# EAGLE design Nixie Clock Display Board IN14 (EAGLE 9.6.0)
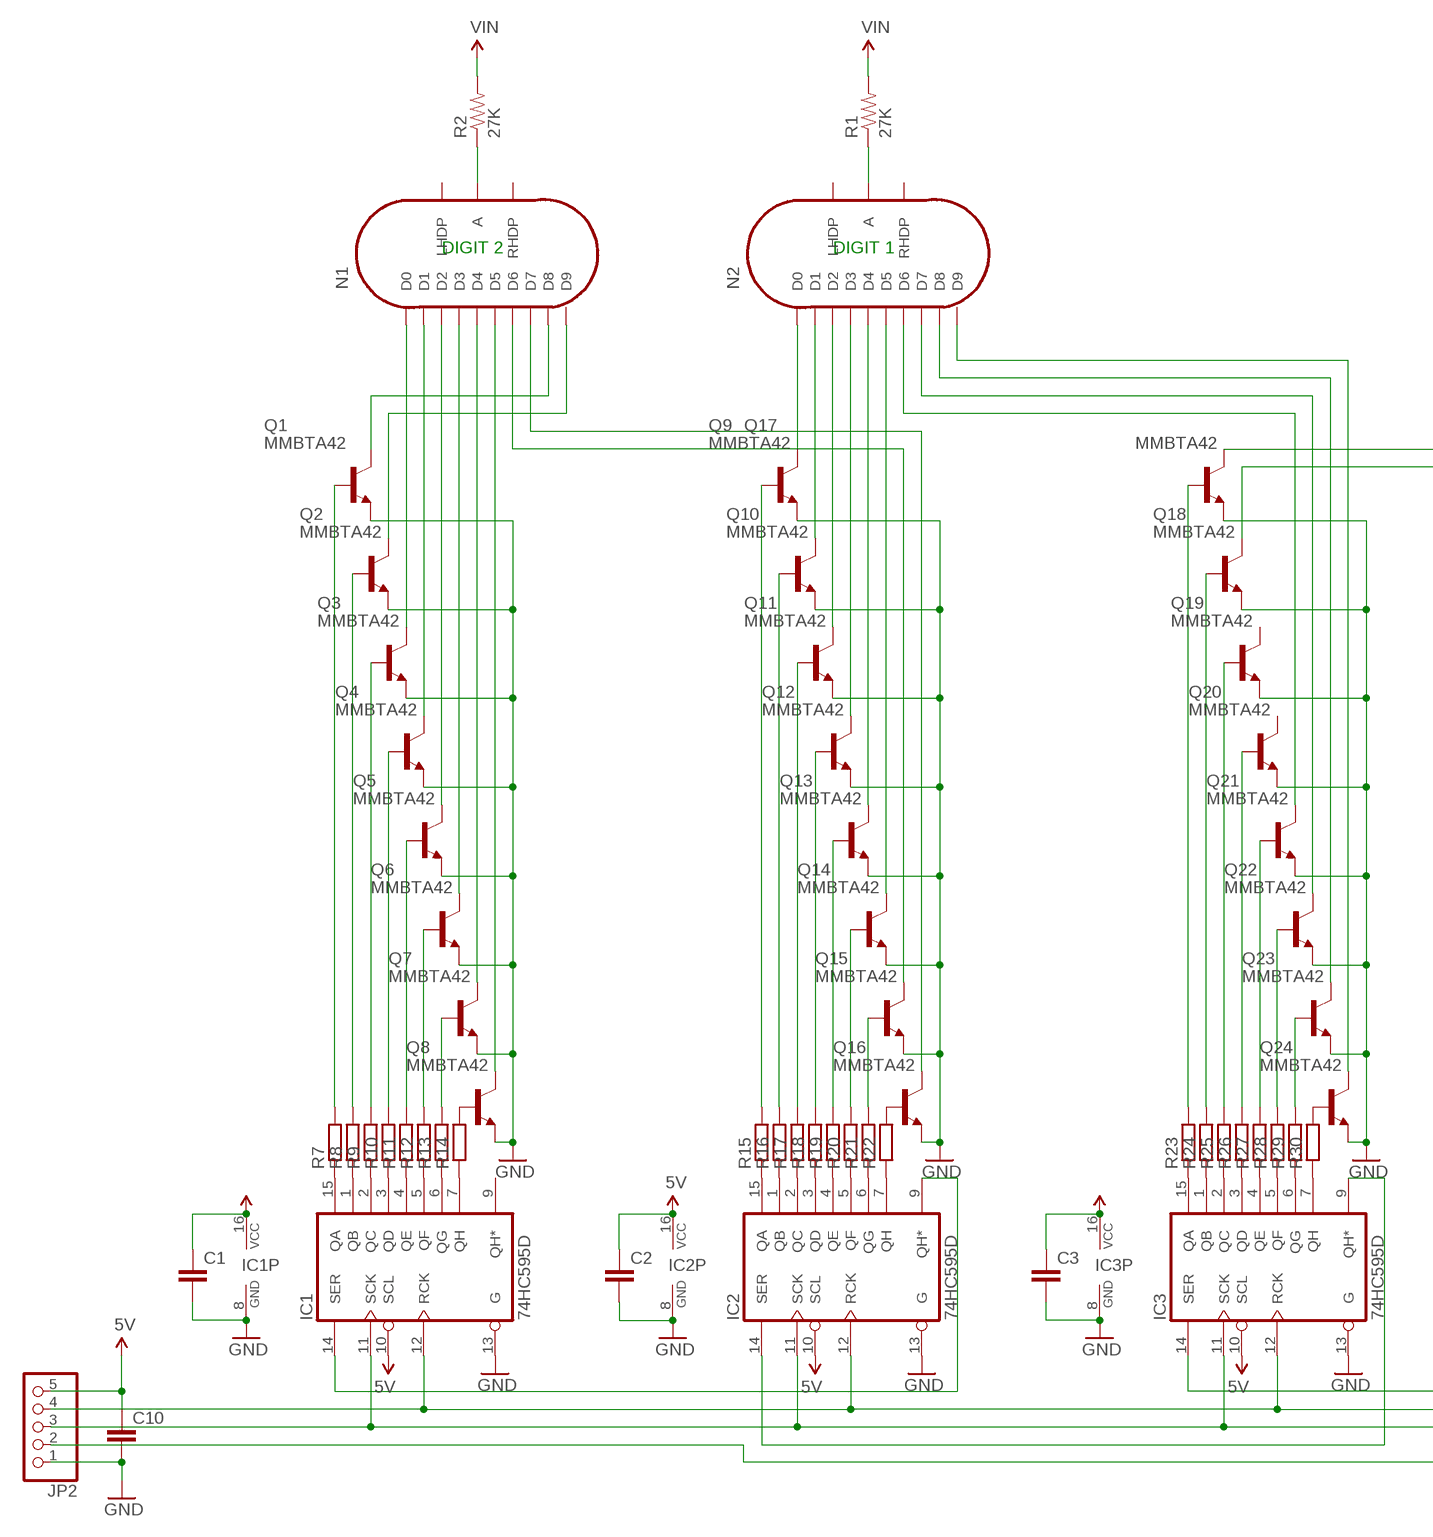
[diagram p0: schematic, sheet 1, part 1 of 2]
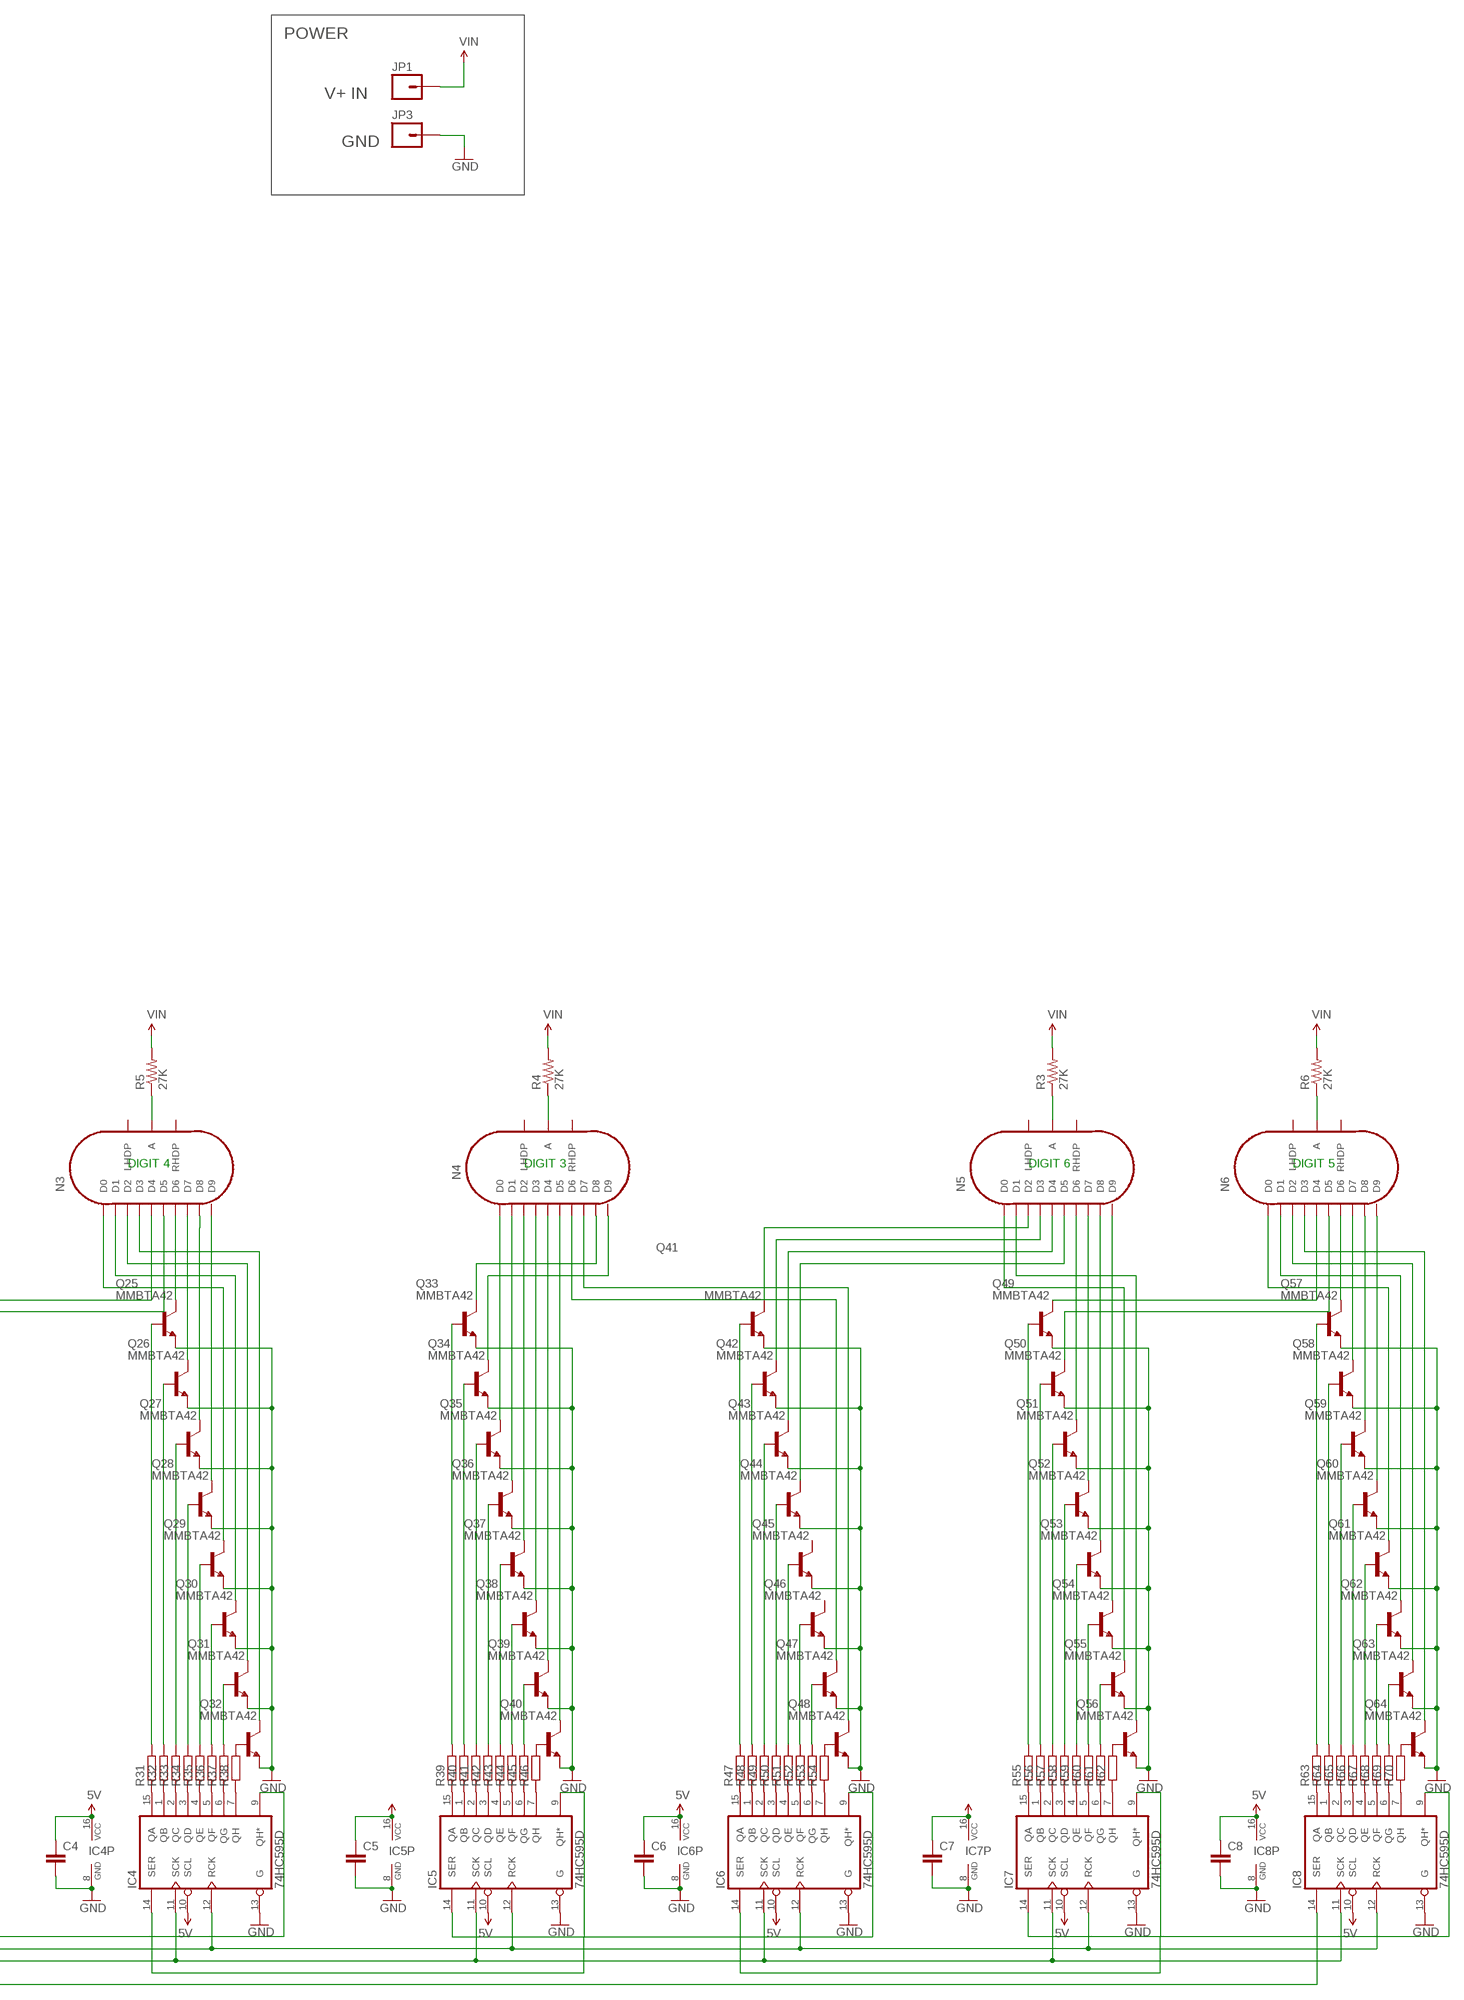
[diagram p1: schematic, sheet 1, part 2 of 2]

## Parts
C1  C-EUC0805  [C0805]
C2  C-EUC0805  [C0805]
C3  C-EUC0805  [C0805]
C4  C-EUC0805  [C0805]
C5  C-EUC0805  [C0805]
C6  C-EUC0805  [C0805]
C7  C-EUC0805  [C0805]
C8  C-EUC0805  [C0805]
C10  C-EUC0805  [C0805]
IC1  74HC595D  [SO16]
IC2  74HC595D  [SO16]
IC3  74HC595D  [SO16]
IC4  74HC595D  [SO16]
IC5  74HC595D  [SO16]
IC6  74HC595D  [SO16]
IC7  74HC595D  [SO16]
IC8  74HC595D  [SO16]
JP1  M01PTH  [1X01]
JP2  PINHD-1X5  [1X05]
JP3  M01PTH  [1X01]
N1  IN-14  [IN-14]
N2  IN-14  [IN-14]
N3  IN-14  [IN-14]
N4  IN-14  [IN-14]
N5  IN-14  [IN-14]
N6  IN-14  [IN-14]
Q1  MMBTA42  [SOT23]
Q2  MMBTA42  [SOT23]
Q3  MMBTA42  [SOT23]
Q4  MMBTA42  [SOT23]
Q5  MMBTA42  [SOT23]
Q6  MMBTA42  [SOT23]
Q7  MMBTA42  [SOT23]
Q8  MMBTA42  [SOT23]
Q9  MMBTA42  [SOT23]
Q10  MMBTA42  [SOT23]
Q11  MMBTA42  [SOT23]
Q12  MMBTA42  [SOT23]
Q13  MMBTA42  [SOT23]
Q14  MMBTA42  [SOT23]
Q15  MMBTA42  [SOT23]
Q16  MMBTA42  [SOT23]
Q17  MMBTA42  [SOT23]
Q18  MMBTA42  [SOT23]
Q19  MMBTA42  [SOT23]
Q20  MMBTA42  [SOT23]
Q21  MMBTA42  [SOT23]
Q22  MMBTA42  [SOT23]
Q23  MMBTA42  [SOT23]
Q24  MMBTA42  [SOT23]
Q25  MMBTA42  [SOT23]
Q26  MMBTA42  [SOT23]
Q27  MMBTA42  [SOT23]
Q28  MMBTA42  [SOT23]
Q29  MMBTA42  [SOT23]
Q30  MMBTA42  [SOT23]
Q31  MMBTA42  [SOT23]
Q32  MMBTA42  [SOT23]
Q33  MMBTA42  [SOT23]
Q34  MMBTA42  [SOT23]
Q35  MMBTA42  [SOT23]
Q36  MMBTA42  [SOT23]
Q37  MMBTA42  [SOT23]
Q38  MMBTA42  [SOT23]
Q39  MMBTA42  [SOT23]
Q40  MMBTA42  [SOT23]
Q41  MMBTA42  [SOT23]
Q42  MMBTA42  [SOT23]
Q43  MMBTA42  [SOT23]
Q44  MMBTA42  [SOT23]
Q45  MMBTA42  [SOT23]
Q46  MMBTA42  [SOT23]
Q47  MMBTA42  [SOT23]
Q48  MMBTA42  [SOT23]
Q49  MMBTA42  [SOT23]
Q50  MMBTA42  [SOT23]
Q51  MMBTA42  [SOT23]
Q52  MMBTA42  [SOT23]
Q53  MMBTA42  [SOT23]
Q54  MMBTA42  [SOT23]
Q55  MMBTA42  [SOT23]
Q56  MMBTA42  [SOT23]
Q57  MMBTA42  [SOT23]
Q58  MMBTA42  [SOT23]
Q59  MMBTA42  [SOT23]
Q60  MMBTA42  [SOT23]
Q61  MMBTA42  [SOT23]
Q62  MMBTA42  [SOT23]
Q63  MMBTA42  [SOT23]
Q64  MMBTA42  [SOT23]
R1  27K  RESISTORPTH-1/2W  [AXIAL-0.5]
R2  27K  RESISTORPTH-1/2W  [AXIAL-0.5]
R3  27K  RESISTORPTH-1/2W  [AXIAL-0.5]
R4  27K  RESISTORPTH-1/2W  [AXIAL-0.5]
R5  27K  RESISTORPTH-1/2W  [AXIAL-0.5]
R6  27K  RESISTORPTH-1/2W  [AXIAL-0.5]
R7  R-EU_R0805  [R0805]
R8  R-EU_R0805  [R0805]
R9  R-EU_R0805  [R0805]
R10  R-EU_R0805  [R0805]
R11  R-EU_R0805  [R0805]
R12  R-EU_R0805  [R0805]
R13  R-EU_R0805  [R0805]
R14  R-EU_R0805  [R0805]
R15  R-EU_R0805  [R0805]
R16  R-EU_R0805  [R0805]
R17  R-EU_R0805  [R0805]
R18  R-EU_R0805  [R0805]
R19  R-EU_R0805  [R0805]
R20  R-EU_R0805  [R0805]
R21  R-EU_R0805  [R0805]
R22  R-EU_R0805  [R0805]
R23  R-EU_R0805  [R0805]
R24  R-EU_R0805  [R0805]
R25  R-EU_R0805  [R0805]
R26  R-EU_R0805  [R0805]
R27  R-EU_R0805  [R0805]
R28  R-EU_R0805  [R0805]
R29  R-EU_R0805  [R0805]
R30  R-EU_R0805  [R0805]
R31  R-EU_R0805  [R0805]
R32  R-EU_R0805  [R0805]
R33  R-EU_R0805  [R0805]
R34  R-EU_R0805  [R0805]
R35  R-EU_R0805  [R0805]
R36  R-EU_R0805  [R0805]
R37  R-EU_R0805  [R0805]
R38  R-EU_R0805  [R0805]
R39  R-EU_R0805  [R0805]
R40  R-EU_R0805  [R0805]
R41  R-EU_R0805  [R0805]
R42  R-EU_R0805  [R0805]
R43  R-EU_R0805  [R0805]
R44  R-EU_R0805  [R0805]
R45  R-EU_R0805  [R0805]
R46  R-EU_R0805  [R0805]
R47  R-EU_R0805  [R0805]
R48  R-EU_R0805  [R0805]
R49  R-EU_R0805  [R0805]
R50  R-EU_R0805  [R0805]
R51  R-EU_R0805  [R0805]
R52  R-EU_R0805  [R0805]
R53  R-EU_R0805  [R0805]
R54  R-EU_R0805  [R0805]
R55  R-EU_R0805  [R0805]
R56  R-EU_R0805  [R0805]
R57  R-EU_R0805  [R0805]
R58  R-EU_R0805  [R0805]
R59  R-EU_R0805  [R0805]
R60  R-EU_R0805  [R0805]
R61  R-EU_R0805  [R0805]
R62  R-EU_R0805  [R0805]
R63  R-EU_R0805  [R0805]
R64  R-EU_R0805  [R0805]
R65  R-EU_R0805  [R0805]
R66  R-EU_R0805  [R0805]
R67  R-EU_R0805  [R0805]
R68  R-EU_R0805  [R0805]
R69  R-EU_R0805  [R0805]
R70  R-EU_R0805  [R0805]

## Nets
5V: C1.1 C2.1 C3.1 C4.1 C5.1 C6.1 C7.1 C8.1 C10.1 IC1.10(SCL) IC1.16(VCC) IC2.10(SCL) IC2.16(VCC) IC3.10(SCL) IC3.16(VCC) IC4.10(SCL) IC4.16(VCC) IC5.10(SCL) IC5.16(VCC) IC6.10(SCL) IC6.16(VCC) IC7.10(SCL) IC7.16(VCC) IC8.10(SCL) IC8.16(VCC) JP2.5
GND: C1.2 C2.2 C3.2 C4.2 C5.2 C6.2 C7.2 C8.2 C10.2 IC1.8(GND) IC1.13(G) IC2.8(GND) IC2.13(G) IC3.8(GND) IC3.13(G) IC4.8(GND) IC4.13(G) IC5.8(GND) IC5.13(G) IC6.8(GND) IC6.13(G) IC7.8(GND) IC7.13(G) IC8.8(GND) IC8.13(G) JP2.1 JP3.1 Q1.2(E) Q2.2(E) Q3.2(E) Q4.2(E) Q5.2(E) Q6.2(E) Q7.2(E) Q8.2(E) Q9.2(E) Q10.2(E) Q11.2(E) Q12.2(E) Q13.2(E) Q14.2(E) Q15.2(E) Q16.2(E) Q17.2(E) Q18.2(E) Q19.2(E) Q20.2(E) Q21.2(E) Q22.2(E) Q23.2(E) Q24.2(E) Q25.2(E) Q26.2(E) Q27.2(E) Q28.2(E) Q29.2(E) Q30.2(E) Q31.2(E) Q32.2(E) Q33.2(E) Q34.2(E) Q35.2(E) Q36.2(E) Q37.2(E) Q38.2(E) Q39.2(E) Q40.2(E) Q41.2(E) Q42.2(E) Q43.2(E) Q44.2(E) Q45.2(E) Q46.2(E) Q47.2(E) Q48.2(E) Q49.2(E) Q50.2(E) Q51.2(E) Q52.2(E) Q53.2(E) Q54.2(E) Q55.2(E) Q56.2(E) Q57.2(E) Q58.2(E) Q59.2(E) Q60.2(E) Q61.2(E) Q62.2(E) Q63.2(E) Q64.2(E)
IN1: IC8.14(SER) JP2.2
IN2: IC1.12(RCK) IC2.12(RCK) IC3.12(RCK) IC4.12(RCK) IC5.12(RCK) IC6.12(RCK) IC7.12(RCK) IC8.12(RCK) JP2.4
IN5: IC1.11(SCK) IC2.11(SCK) IC3.11(SCK) IC4.11(SCK) IC5.11(SCK) IC6.11(SCK) IC7.11(SCK) IC8.11(SCK) JP2.3
IN7: IC2.14(SER) IC3.9(QH*)
IN8: IC4.14(SER) IC5.9(QH*)
IN12: IC5.14(SER) IC6.9(QH*)
IN13: IC6.14(SER) IC7.9(QH*)
N$1: Q1.1(B) R7.2
N$2: IC1.15(QA) R7.1
N$3: IC1.1(QB) R8.1
N$4: IC1.2(QC) R9.1
N$5: IC1.3(QD) R10.1
N$6: IC1.4(QE) R11.1
N$7: IC1.5(QF) R12.1
N$8: IC1.6(QG) R13.1
N$9: IC1.7(QH) R14.1
N$10: Q8.1(B) R14.2
N$11: Q7.1(B) R13.2
N$12: Q6.1(B) R12.2
N$13: Q5.1(B) R11.2
N$14: Q4.1(B) R10.2
N$15: Q3.1(B) R9.2
N$16: Q2.1(B) R8.2
N$17: Q9.1(B) R15.2
N$18: Q16.1(B) R22.2
N$19: Q15.1(B) R21.2
N$20: Q14.1(B) R20.2
N$21: Q13.1(B) R19.2
N$22: Q12.1(B) R18.2
N$25: Q11.1(B) R17.2
N$26: Q10.1(B) R16.2
N$27: N6.D0 Q61.3(C)
N$28: IC1.14(SER) IC2.9(QH*)
N$29: N5.A R3.P$1
N$30: IC2.15(QA) R15.1
N$31: IC2.1(QB) R16.1
N$32: IC2.2(QC) R17.1
N$33: IC2.3(QD) R18.1
N$34: IC2.4(QE) R19.1
N$35: IC2.5(QF) R20.1
N$36: IC2.6(QG) R21.1
N$37: IC2.7(QH) R22.1
N$38: Q17.1(B) R23.2
N$39: Q24.1(B) R30.2
N$40: N6.A R6.P$1
N$41: Q23.1(B) R29.2
N$42: Q22.1(B) R28.2
N$43: Q21.1(B) R27.2
N$44: Q20.1(B) R26.2
N$45: Q19.1(B) R25.2
N$46: Q18.1(B) R24.2
N$47: IC3.15(QA) R23.1
N$48: IC3.1(QB) R24.1
N$49: IC3.2(QC) R25.1
N$50: IC3.3(QD) R26.1
N$51: IC3.4(QE) R27.1
N$52: IC3.5(QF) R28.1
N$53: IC3.6(QG) R29.1
N$54: IC3.7(QH) R30.1
N$55: N4.A R4.P$1
N$56: N3.A R5.P$1
N$57: IC3.14(SER) IC4.9(QH*)
N$58: N6.D1 Q62.3(C)
N$59: IC7.14(SER) IC8.9(QH*)
N$60: N6.D2 Q63.3(C)
N$61: N6.D3 Q64.3(C)
N$63: Q25.1(B) R31.2
N$64: Q32.1(B) R38.2
N$65: Q31.1(B) R37.2
N$66: Q30.1(B) R36.2
N$67: Q29.1(B) R35.2
N$68: Q28.1(B) R34.2
N$69: Q27.1(B) R33.2
N$70: Q26.1(B) R32.2
N$71: IC4.15(QA) R31.1
N$72: IC4.1(QB) R32.1
N$73: IC4.2(QC) R33.1
N$74: IC4.3(QD) R34.1
N$75: IC4.4(QE) R35.1
N$76: IC4.5(QF) R36.1
N$77: IC4.6(QG) R37.1
N$78: IC4.7(QH) R38.1
N$79: Q33.1(B) R39.2
N$80: Q40.1(B) R46.2
N$81: Q39.1(B) R45.2
N$82: Q38.1(B) R44.2
N$83: N2.A R1.P$1
N$84: N1.A R2.P$1
N$87: N6.D4 Q49.3(C)
N$88: N6.D5 Q50.3(C)
N$89: N6.D6 Q57.3(C)
N$90: N6.D7 Q58.3(C)
N$91: N6.D8 Q59.3(C)
N$92: N6.D9 Q60.3(C)
N$95: Q37.1(B) R43.2
N$96: Q36.1(B) R42.2
N$97: Q35.1(B) R41.2
N$98: Q34.1(B) R40.2
N$99: IC5.15(QA) R39.1
N$100: IC5.1(QB) R40.1
N$101: IC5.2(QC) R41.1
N$102: IC5.3(QD) R42.1
N$107: N3.D0 Q29.3(C)
N$108: N3.D1 Q30.3(C)
N$109: N3.D2 Q31.3(C)
N$110: N3.D3 Q32.3(C)
N$111: N3.D4 Q17.3(C)
N$112: N5.D0 Q55.3(C)
N$118: N3.D5 Q18.3(C)
N$119: N3.D6 Q25.3(C)
N$120: N3.D7 Q26.3(C)
N$121: N3.D8 Q27.3(C)
N$122: N3.D9 Q28.3(C)
N$123: IC5.4(QE) R43.1
N$124: IC5.5(QF) R44.1
N$125: IC5.6(QG) R45.1
N$126: IC5.7(QH) R46.1
N$127: Q41.1(B) R47.2
N$128: Q48.1(B) R54.2
N$129: Q47.1(B) R53.2
N$130: Q46.1(B) R52.2
N$131: N2.D0 Q9.3(C)
N$132: N2.D1 Q10.3(C)
N$133: N2.D2 Q11.3(C)
N$134: N2.D3 Q12.3(C)
N$135: N2.D4 Q13.3(C)
N$136: N2.D5 Q14.3(C)
N$137: N2.D6 Q21.3(C)
N$138: N2.D7 Q22.3(C)
N$139: N2.D8 Q23.3(C)
N$140: N2.D9 Q24.3(C)
N$141: N1.D0 Q3.3(C)
N$142: N1.D1 Q4.3(C)
N$143: N1.D2 Q5.3(C)
N$144: N1.D3 Q6.3(C)
N$145: N1.D4 Q7.3(C)
N$146: N1.D5 Q8.3(C)
N$147: N1.D6 Q15.3(C)
N$148: N1.D7 Q16.3(C)
N$149: N1.D8 Q1.3(C)
N$150: N1.D9 Q2.3(C)
N$151: Q45.1(B) R51.2
N$152: Q44.1(B) R50.2
N$153: Q43.1(B) R49.2
N$154: Q42.1(B) R48.2
N$155: IC6.15(QA) R47.1
N$156: IC6.1(QB) R48.1
N$157: IC6.2(QC) R49.1
N$158: IC6.3(QD) R50.1
N$159: IC6.4(QE) R51.1
N$160: IC6.5(QF) R52.1
N$161: IC6.6(QG) R53.1
N$162: IC6.7(QH) R54.1
N$163: Q49.1(B) R55.2
N$164: Q56.1(B) R62.2
N$165: Q55.1(B) R61.2
N$166: Q54.1(B) R60.2
N$167: Q53.1(B) R59.2
N$168: Q52.1(B) R58.2
N$169: Q51.1(B) R57.2
N$170: Q50.1(B) R56.2
N$171: IC7.15(QA) R55.1
N$172: IC7.1(QB) R56.1
N$173: IC7.2(QC) R57.1
N$174: IC7.3(QD) R58.1
N$175: IC7.4(QE) R59.1
N$176: IC7.5(QF) R60.1
N$177: IC7.6(QG) R61.1
N$178: IC7.7(QH) R62.1
N$179: Q57.1(B) R63.2
N$180: Q64.1(B) R70.2
N$181: Q63.1(B) R69.2
N$182: Q62.1(B) R68.2
N$183: Q61.1(B) R67.2
N$184: Q60.1(B) R66.2
N$185: Q59.1(B) R65.2
N$186: Q58.1(B) R64.2
N$187: IC8.15(QA) R63.1
N$188: IC8.1(QB) R64.1
N$189: IC8.2(QC) R65.1
N$190: IC8.3(QD) R66.1
N$191: IC8.4(QE) R67.1
N$192: IC8.5(QF) R68.1
N$193: IC8.6(QG) R69.1
N$194: IC8.7(QH) R70.1
N$195: N5.D1 Q56.3(C)
N$196: N5.D2 Q41.3(C)
N$197: N5.D3 Q42.3(C)
N$198: N5.D4 Q43.3(C)
N$199: N5.D5 Q44.3(C)
N$200: N5.D6 Q51.3(C)
N$201: N5.D7 Q52.3(C)
N$202: N5.D8 Q53.3(C)
N$203: N5.D9 Q54.3(C)
N$204: N4.D0 Q35.3(C)
N$205: N4.D1 Q36.3(C)
N$206: N4.D2 Q37.3(C)
N$207: N4.D3 Q38.3(C)
N$208: N4.D4 Q39.3(C)
N$209: N4.D5 Q40.3(C)
N$210: N4.D6 Q47.3(C)
N$211: N4.D7 Q48.3(C)
N$212: N4.D8 Q33.3(C)
N$213: N4.D9 Q34.3(C)
VIN: JP1.1 R1.P$2 R2.P$2 R3.P$2 R4.P$2 R5.P$2 R6.P$2
Unconnected: IC1.9(QH*) N1.LHDP N1.RHDP N2.LHDP N2.RHDP N3.LHDP N3.RHDP N4.LHDP N4.RHDP N5.LHDP N5.RHDP N6.LHDP N6.RHDP Q19.3(C) Q20.3(C) Q45.3(C) Q46.3(C)

## Notes on the sheet
- POWER
- V+ IN
- GND
- DIGIT 2 | DIGIT 1 | DIGIT 4 | DIGIT 3 | DIGIT 6 | DIGIT 5

## Library data of the parts
C1-C8 C10 = rcl:C-EU: CAPACITOR, European symbol; SPICEPREFIX: C
IC1-IC8 = 74xx-eu:74*595: 8-bit SHIFT REGISTER, output latch
JP1 JP3 = SparkFun-Connectors:M01: Header 1 Standard 1-pin 0.1" header. Use with straight break away headers (SKU : PRT-00116), right angle break away headers (PRT-00553), swiss pins (PRT-00743), machine pins (PRT-00117), and female headers (PRT-00115). SMTSO-256-ET is a "flush mount" nut for a 4-40 screw. The older package used to be too tight, and did not allow it to sit properly thru the drill hit. The latest (0.165DIA) fits nice and snug.
JP2 = pinhead:PINHD-1X5: PIN HEADER
N1-N6 = russian-nixies:IN-14: IN-14: medium numeric frontview nixie tube
Q1-Q64 = MMBTA42:MMBTA42: NPN TRANSISTOR Check prices <https://pricing.snapeda.com/parts/MMBTA42/Diotec%20Semiconductor/view-part?ref=eda>; AVAILABILITY: Warning; DESCRIPTION: Bipolar (BJT) Transistor NPN 300V 500mA 50MHz 300mW Surface Mount SOT-23-3; MF: Diotec Semiconductor; MP: MMBTA42; PACKAGE: TO-236-3 Diotec Semiconductor; PRICE: None
R1-R6 = SparkFun-Resistors:RESISTOR: Resistor Basic schematic elements and footprints for 0603, 1206, and PTH resistors.
R7-R70 = rcl:R-EU_: RESISTOR, European symbol; SPICEPREFIX: R

## Board
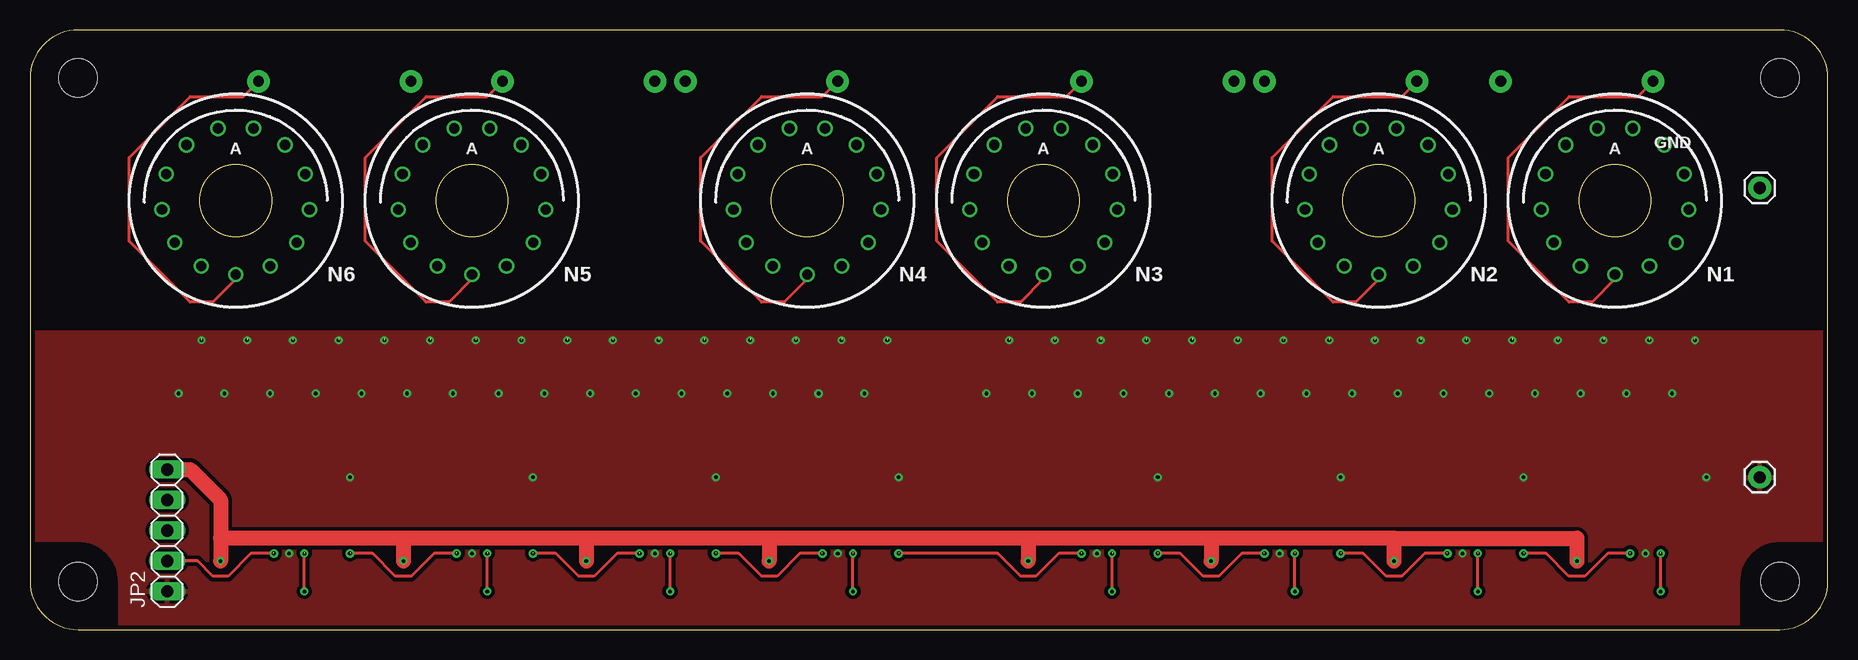
[diagram p2: board, top side]
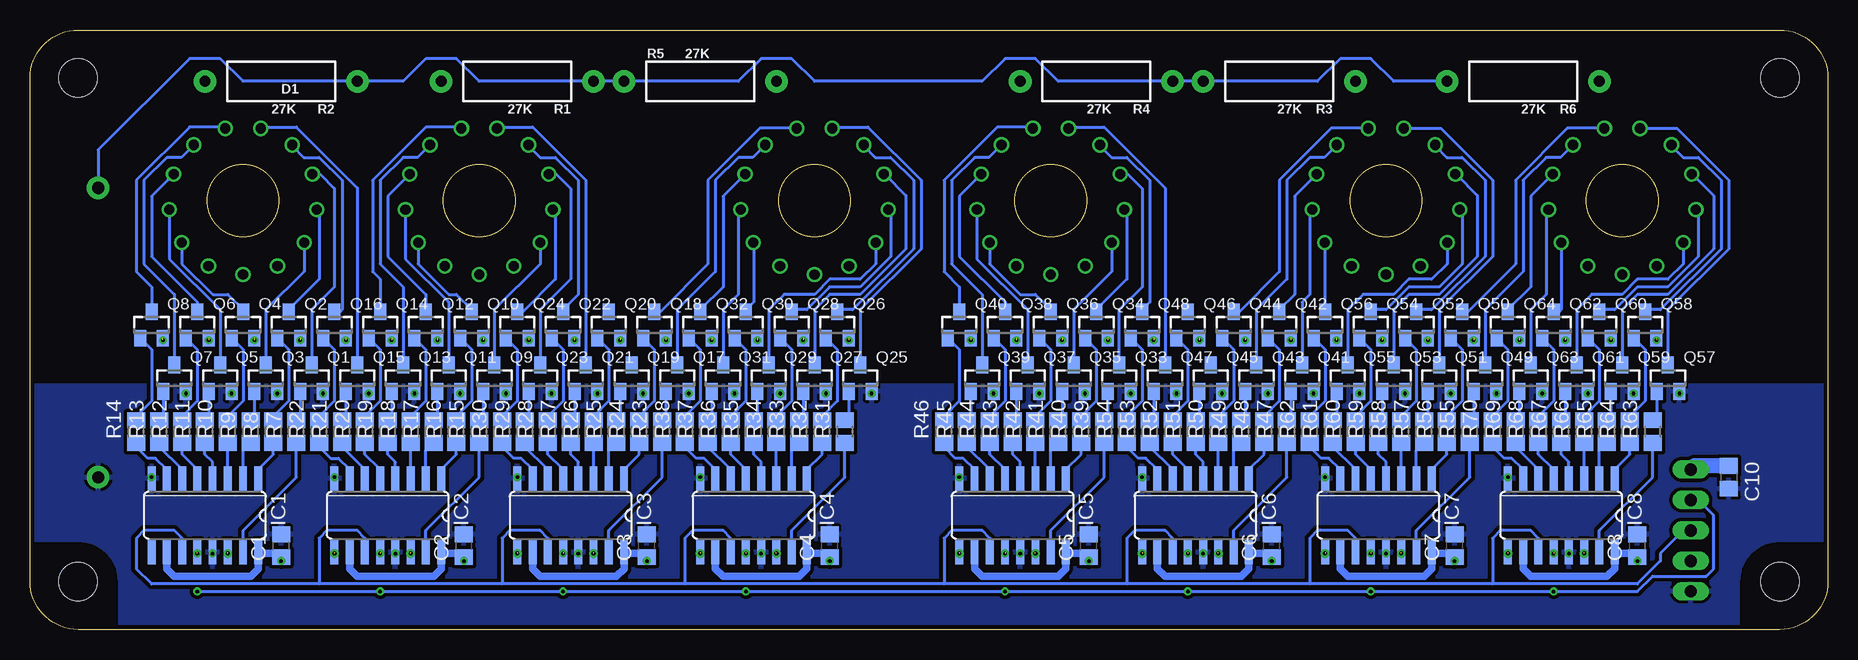
[diagram p3: board, bottom side, seen from below]

Size 149.83 x 50 mm. Coordinates in mm from the lower left corner, seen from the top.
Outline: circle at 17.14,35.78 radius 3
Outline: circle at 36.83,35.78 radius 3
Outline: circle at 64.77,35.78 radius 3
Outline: circle at 84.45,35.78 radius 3
Outline: circle at 112.39,35.78 radius 3
Outline: circle at 132.08,35.78 radius 3
Copper layers (1*16): Top 0.0356mm / dielectric 1.5011mm / Bottom 0.0356mm
Design rules "LaenPCBOrder *": minimum track width 6mil, minimum drill 6mil, track to track 6mil, track to pad 6mil, pad to pad 12mil, via to via 6mil, smd to smd 6mil, copper to edge 15mil, drill to drill 6mil, minimum pad ring 7mil, minimum via ring 7mil, stop-mask expansion 3mil, vias tented up to drill 0mil, thermal gap 10mil

### Footprints (pad centres in the part's own frame; a part is rotated, then mirrored left to right if it is on the bottom)
C0805 = smd 1.3 x 1.5: 1 -0.95,0; 2 0.95,0
SO16 = smd 0.66 x 2.032: 1 -4.445,-3.073; 2 -3.175,-3.073; 3 -1.905,-3.073; 4 -0.635,-3.073; 5 0.635,-3.073; 6 1.905,-3.073; 7 3.175,-3.073; 8 4.445,-3.073; 9 4.445,3.073; 10 3.175,3.073; 11 1.905,3.073; 12 0.635,3.073; 13 -0.635,3.073; 14 -1.905,3.073; 15 -3.175,3.073; 16 -4.445,3.073
1X01 = drill 1.016 pad 1.88: 1 0,0
1X05 = drill 1.016 long: 1 -5.08,0; 2 -2.54,0; 3 0,0; 4 2.54,0; 5 5.08,0
IN-14 = drill 0.84: A 0,-6.19; D0 -5.094,-3.516; D1 5.094,-3.516; D2 6.145,-0.746; D3 5.788,2.195; D4 4.105,4.633; D5 1.481,6.01; D6 -1.481,6.01; D7 -4.105,4.633; D8 -5.788,2.195; D9 -6.145,-0.746; LHDP 2.877,-5.481; RHDP -2.877,-5.481
SOT23 = smd 1 x 1.4: 1 -0.95,-1.1; 2 0.95,-1.1; 3 0,1.1
AXIAL-0.5 = drill 0.9 pad 1.88: P$1 -6.35,0; P$2 6.35,0
R0805 = smd 1.3 x 1.5: 1 -0.95,0; 2 0.95,0
50X150 = hole 3.2: 4,4; 145.83,4; 145.83,46; 4,46

### Placement (x,y rotation side)
C1  128.91,6.99 90 bottom
C2  113.67,6.99 90 bottom
C3  98.42,6.99 90 bottom
C4  83.19,6.99 90 bottom
C5  61.59,6.99 90 bottom
C6  46.35,6.99 90 bottom
C7  31.11,6.99 90 bottom
C8  15.88,6.99 90 bottom
C10  8.26,12.7 270 bottom
IC1  135.25,9.53 180 bottom
IC2  120.02,9.53 180 bottom
IC3  104.78,9.53 180 bottom
IC4  89.53,9.53 180 bottom
IC5  67.94,9.53 180 bottom
IC6  52.7,9.53 180 bottom
IC7  37.47,9.53 180 bottom
IC8  22.23,9.53 180 bottom
JP1  144.15,36.83 0 top
JP2  11.43,8.26 90 top
JP3  144.15,12.7 0 top
N1  132.08,35.78 0 top
N2  112.39,35.78 0 top
N3  84.45,35.78 0 top
N4  64.77,35.78 0 top
N5  36.83,35.78 0 top
N6  17.14,35.78 0 top
Q1  126.36,20.95 0 bottom
Q2  128.27,25.4 0 bottom
Q3  130.18,20.95 0 bottom
Q4  132.08,25.4 0 bottom
Q5  133.99,20.95 0 bottom
Q6  135.89,25.4 0 bottom
Q7  137.79,20.95 0 bottom
Q8  139.7,25.4 0 bottom
Q9  111.12,20.95 0 bottom
Q10  113.03,25.4 0 bottom
Q11  114.94,20.95 0 bottom
Q12  116.84,25.4 0 bottom
Q13  118.75,20.95 0 bottom
Q14  120.65,25.4 0 bottom
Q15  122.56,20.95 0 bottom
Q16  124.46,25.4 0 bottom
Q17  95.89,20.95 0 bottom
Q18  97.79,25.4 0 bottom
Q19  99.69,20.95 0 bottom
Q20  101.6,25.4 0 bottom
Q21  103.5,20.95 0 bottom
Q22  105.41,25.4 0 bottom
Q23  107.31,20.95 0 bottom
Q24  109.22,25.4 0 bottom
Q25  80.64,20.95 0 bottom
Q26  82.55,25.4 0 bottom
Q27  84.45,20.95 0 bottom
Q28  86.36,25.4 0 bottom
Q29  88.27,20.95 0 bottom
Q30  90.17,25.4 0 bottom
Q31  92.08,20.95 0 bottom
Q32  93.98,25.4 0 bottom
Q33  59.05,20.95 0 bottom
Q34  60.96,25.4 0 bottom
Q35  62.87,20.95 0 bottom
Q36  64.77,25.4 0 bottom
Q37  66.67,20.95 0 bottom
Q38  68.58,25.4 0 bottom
Q39  70.48,20.95 0 bottom
Q40  72.39,25.4 0 bottom
Q41  43.81,20.95 0 bottom
Q42  45.72,25.4 0 bottom
Q43  47.62,20.95 0 bottom
Q44  49.53,25.4 0 bottom
Q45  51.44,20.95 0 bottom
Q46  53.34,25.4 0 bottom
Q47  55.24,20.95 0 bottom
Q48  57.15,25.4 0 bottom
Q49  28.57,20.95 0 bottom
Q50  30.48,25.4 0 bottom
Q51  32.38,20.95 0 bottom
Q52  34.29,25.4 0 bottom
Q53  36.2,20.95 0 bottom
Q54  38.1,25.4 0 bottom
Q55  40.01,20.95 0 bottom
Q56  41.91,25.4 0 bottom
Q57  13.34,20.95 0 bottom
Q58  15.24,25.4 0 bottom
Q59  17.14,20.95 0 bottom
Q60  19.05,25.4 0 bottom
Q61  20.95,20.95 0 bottom
Q62  22.86,25.4 0 bottom
Q63  24.77,20.95 0 bottom
Q64  26.67,25.4 0 bottom
R1  109.22,45.72 0 bottom
R2  128.91,45.72 0 bottom
R3  45.72,45.72 180 bottom
R4  60.96,45.72 0 bottom
R5  93.98,45.72 180 bottom
R6  25.4,45.72 180 bottom
R7  127.64,16.51 90 bottom
R8  129.54,16.51 90 bottom
R9  131.44,16.51 90 bottom
R10  133.35,16.51 90 bottom
R11  135.25,16.51 90 bottom
R12  137.16,16.51 90 bottom
R13  139.06,16.51 90 bottom
R14  140.97,16.51 90 bottom
R15  112.39,16.51 90 bottom
R16  114.3,16.51 90 bottom
R17  116.2,16.51 90 bottom
R18  118.11,16.51 90 bottom
R19  120.02,16.51 90 bottom
R20  121.92,16.51 90 bottom
R21  123.83,16.51 90 bottom
R22  125.73,16.51 90 bottom
R23  97.16,16.51 90 bottom
R24  99.06,16.51 90 bottom
R25  100.97,16.51 90 bottom
R26  102.87,16.51 90 bottom
R27  104.78,16.51 90 bottom
R28  106.68,16.51 90 bottom
R29  108.58,16.51 90 bottom
R30  110.49,16.51 90 bottom
R31  81.92,16.51 90 bottom
R32  83.82,16.51 90 bottom
R33  85.72,16.51 90 bottom
R34  87.63,16.51 90 bottom
R35  89.53,16.51 90 bottom
R36  91.44,16.51 90 bottom
R37  93.34,16.51 90 bottom
R38  95.25,16.51 90 bottom
R39  60.33,16.51 90 bottom
R40  62.23,16.51 90 bottom
R41  64.14,16.51 90 bottom
R42  66.04,16.51 90 bottom
R43  67.94,16.51 90 bottom
R44  69.85,16.51 90 bottom
R45  71.75,16.51 90 bottom
R46  73.66,16.51 90 bottom
R47  45.09,16.51 90 bottom
R48  46.99,16.51 90 bottom
R49  48.9,16.51 90 bottom
R50  50.8,16.51 90 bottom
R51  52.7,16.51 90 bottom
R52  54.61,16.51 90 bottom
R53  56.52,16.51 90 bottom
R54  58.42,16.51 90 bottom
R55  29.84,16.51 90 bottom
R56  31.75,16.51 90 bottom
R57  33.66,16.51 90 bottom
R58  35.56,16.51 90 bottom
R59  37.47,16.51 90 bottom
R60  39.37,16.51 90 bottom
R61  41.27,16.51 90 bottom
R62  43.18,16.51 90 bottom
R63  14.61,16.51 90 bottom
R64  16.51,16.51 90 bottom
R65  18.41,16.51 90 bottom
R66  20.32,16.51 90 bottom
R67  22.23,16.51 90 bottom
R68  24.13,16.51 90 bottom
R69  26.04,16.51 90 bottom
R70  27.94,16.51 90 bottom
U$1  [50X150]  0,0 0 top

### Tracks (layer width: path | path; a pad name or v marks a point on that pad's centre or on a via)
5V  (via drill 0.3)
  Top 1.27: 113.67,7.62 128.91,7.62 v128.91,5.71 | 113.67,7.62 98.42,7.62 | 98.42,7.62 83.19,7.62 | 83.19,7.62 61.59,7.62 | 61.59,7.62 46.35,7.62 | 46.35,7.62 31.11,7.62 | 31.11,7.62 v31.11,5.71 | 46.35,7.62 v46.35,5.71 | 61.59,7.62 v61.59,5.71 | 83.19,7.62 v83.19,5.71 | 113.67,7.62 v113.67,5.71 | 15.88,7.62 v15.88,5.71 | 31.11,7.62 15.88,7.62 | 98.42,7.62 v98.42,5.71 | JP2.5 13.34,13.34 15.88,10.79 15.88,7.62
  Bottom 0.254: C8.1 v15.88,5.71 | C6.1 v46.35,5.71 | C4.1 v83.19,5.71 | C7.1 v31.11,5.71 | C5.1 v61.59,5.71 | C3.1 v98.42,5.71 | C2.1 v113.67,5.71 | C1.1 v128.91,5.71
  Bottom 0.61: IC1.10 138.43,5.08 137.79,4.45 131.44,4.45 130.81,5.08 IC1.16 130.71,6.35 129.54,6.35 v128.91,5.71 | IC2.10 123.19,5.08 122.56,4.45 116.2,4.45 115.57,5.08 IC2.16 115.47,6.35 113.98,6.35 C2.1 | IC3.10 107.95,5.08 107.31,4.45 100.97,4.45 100.33,5.08 IC3.16 100.23,6.35 98.74,6.35 C3.1 | IC4.10 92.71,5.08 92.08,4.45 85.72,4.45 85.09,5.08 IC4.16 | IC5.10 71.12,5.08 70.48,4.45 64.14,4.45 63.5,5.08 IC5.16 | IC6.10 55.88,5.08 55.24,4.45 48.9,4.45 48.26,5.08 IC6.16 | IC7.10 40.64,5.08 40.01,4.45 33.66,4.45 33.02,5.08 IC7.16 | IC8.10 25.4,5.08 24.77,4.45 18.41,4.45 17.78,5.08 IC8.16 | IC4.16 85.09,6.99 | IC5.16 63.5,6.99 | IC6.16 48.26,6.99 | IC7.16 33.02,6.99 | IC8.16 17.78,6.99 | IC6.16 48.16,6.35 46.67,6.35 C6.1 | IC5.16 63.4,6.35 61.91,6.35 C5.1 | IC4.16 84.99,6.35 83.5,6.35 C4.1 | IC7.16 32.92,6.35 31.43,6.35 C7.1 | IC8.16 17.68,6.35 16.19,6.35 C8.1
  Bottom 1.27: C10.1 11.12,13.65 JP2.5
GND  (via drill 0.3, 0.35)  (32 unrouted)
  other vias: 139.7,12.7 124.46,12.7 109.22,12.7 134.62,6.35 119.38,6.35 104.14,6.35 93.98,12.7 26.67,12.7 41.91,12.7 72.39,12.7 57.15,12.7 36.83,6.35 21.59,6.35 88.9,6.35 67.31,6.35 52.07,6.35 138.75,24.13 136.84,19.68 134.94,24.13 133.03,19.68 129.22,19.68 131.13,24.13 127.32,24.13 125.41,19.68 121.6,19.68 123.51,24.13 119.7,24.13 117.79,19.68 113.98,19.68 115.89,24.13 112.08,24.13 110.17,19.68 106.36,19.68 108.27,24.13 104.46,24.13 100.65,24.13 102.55,19.68 98.74,19.68 96.84,24.13 94.93,19.68 93.03,24.13 91.12,19.68 89.22,24.13 85.41,24.13 83.5,19.68 81.6,24.13 79.69,19.68 69.53,19.68 67.63,24.13 71.44,24.13 63.82,24.13 61.91,19.68 58.1,19.68 60.01,24.13 56.2,24.13 54.29,19.68 52.39,24.13 50.48,19.68 48.58,24.13 46.67,19.68 42.86,19.68 44.77,24.13 40.96,24.13 39.05,19.68 35.24,19.68 37.15,24.13 33.34,24.13 31.43,19.68 29.53,24.13 27.62,19.68 23.81,19.68 25.72,24.13 21.91,24.13 20,19.68 18.1,24.13 16.19,19.68 12.38,19.68 14.29,24.13 87.31,19.68 65.72,19.68
  pour Bottom (isolate 0.305): 0,20.32 149.86,20.32 149.86,-0.64 0,-0.64
  pour Top (isolate 0.305): 0,24.77 149.86,24.77 149.86,0 0,0
IN1  (via drill 0.35)  (1 unrouted)
  Top 0.254: JP2.2 13.97,5.71 15.24,4.45 16.51,4.45 18.41,6.35 v20.32,6.35
IN2  (via drill 0.3)  (8 unrouted)
  Top 0.254: v22.86,3.17 v22.86,6.35 | v38.1,3.17 v38.1,6.35 | v53.34,3.17 v53.34,6.35 | v68.58,3.17 v68.58,6.35 | v90.17,3.17 v90.17,6.35 | v105.41,3.17 v105.41,6.35 | v120.65,3.17 v120.65,6.35 | v135.89,3.17 v135.89,6.35
  Bottom 0.254: v135.89,3.17 v120.65,3.17 v105.41,3.17 v90.17,3.17 v68.58,3.17 v53.34,3.17 v38.1,3.17 v22.86,3.17 15.88,3.17 14.61,4.45 10.16,4.45 9.53,5.08 9.53,9.53 10.79,10.79 JP2.4
IN5
  Bottom 0.254: IC8.11 24.13,7.62 24.77,8.26 27.3,8.26 27.94,7.62 27.94,3.81 | 27.94,3.81 43.18,3.81 | 43.18,3.81 58.42,3.81 | 58.42,3.81 73.66,3.81 | 73.66,3.81 95.25,3.81 | 95.25,3.81 110.49,3.81 | 110.49,3.81 125.73,3.81 | 125.73,3.81 139.7,3.81 140.97,5.08 140.97,7.62 140.34,8.26 137.79,8.26 137.16,7.62 IC1.11 | IC7.11 39.37,7.62 40.01,8.26 42.55,8.26 43.18,7.62 43.18,3.81 | IC6.11 54.61,7.62 55.24,8.26 57.78,8.26 58.42,7.62 58.42,3.81 | IC5.11 69.85,7.62 70.48,8.26 73.03,8.26 73.66,7.62 73.66,3.81 | IC4.11 91.44,7.62 92.08,8.26 94.61,8.26 95.25,7.62 95.25,3.81 | IC3.11 106.68,7.62 107.31,8.26 109.86,8.26 110.49,7.62 110.49,3.81 | IC2.11 121.92,7.62 122.56,8.26 125.09,8.26 125.73,7.62 125.73,3.81 | JP2.3 12.06,8.26 13.97,6.35 13.97,5.71 15.88,3.81 27.94,3.81
IN7  (via drill 0.35)  (2 unrouted)
  Top 0.254: v118.11,6.35 116.23,6.35 114.32,4.45 113.01,4.45 111.1,6.35 v109.22,6.35
IN8  (via drill 0.35)  (2 unrouted)
  Top 0.254: v87.63,6.35 85.72,6.35 83.82,4.45 82.55,4.45 80.64,6.35 v72.39,6.35
IN12  (via drill 0.35)  (2 unrouted)
  Top 0.254: v66.04,6.35 64.16,6.35 62.25,4.45 60.96,4.45 59.05,6.35 v57.15,6.35
IN13  (via drill 0.35)  (2 unrouted)
  Top 0.254: v50.8,6.35 48.92,6.35 47.01,4.45 45.72,4.45 43.81,6.35 v41.91,6.35
N$1
  Bottom 0.254: Q1.1 127.31,17.78 R7.2
N$2
  Bottom 0.254: IC1.15 132.08,8.26 127.64,12.7 R7.1
N$3
  Bottom 0.254: IC1.1 130.81,13.34 129.54,14.61 R8.1
N$4
  Bottom 0.254: IC1.2 132.08,14.93 R9.1
N$5
  Bottom 0.254: IC1.3 R10.1
N$6
  Bottom 0.254: IC1.4 134.62,13.97 135.25,14.61 R11.1
N$7
  Bottom 0.254: IC1.5 135.89,13.34 137.16,14.61 R12.1
N$8
  Bottom 0.254: IC1.6 137.16,13.34 139.06,15.24 R13.1
N$9
  Bottom 0.254: 140.76,15.56 R14.1 140.97,15.24 140.02,14.29 139.38,14.29 138.43,13.34 IC1.7
N$10
  Bottom 0.254: Q8.1 139.7,23.35 139.7,19.05 140.97,17.78 141.6,17.78 141.28,17.46 R14.2
N$11
  Bottom 0.254: Q7.1 138.75,17.78 R13.2
N$12
  Bottom 0.254: Q6.1 135.89,23.35 135.89,19.05 137.16,17.78 R12.2
N$13
  Bottom 0.254: Q5.1 134.94,17.78 R11.2
N$14
  Bottom 0.254: Q4.1 132.08,23.35 132.08,19.05 133.35,17.78 R10.2
N$15
  Bottom 0.254: Q3.1 131.12,17.78 R9.2
N$16
  Bottom 0.254: Q2.1 128.27,23.35 128.27,19.05 129.54,17.78 R8.2
N$17
  Bottom 0.254: Q9.1 112.08,17.78 R15.2
N$18
  Bottom 0.254: Q16.1 124.46,23.35 124.46,19.05 125.73,17.78 R22.2
N$19
  Bottom 0.254: Q15.1 123.5,17.78 R21.2
N$20
  Bottom 0.254: Q14.1 120.65,23.35 120.65,19.05 121.92,17.78 R20.2
N$21
  Bottom 0.254: Q13.1 119.69,17.78 R19.2
N$22
  Bottom 0.254: Q12.1 116.84,23.35 116.84,19.05 118.11,17.78 118.75,17.78 118.42,17.46 R18.2
N$25
  Bottom 0.254: Q11.1 115.89,17.78 R17.2
N$26
  Bottom 0.254: Q10.1 113.03,23.35 113.03,19.05 114.3,17.78 R16.2
N$27
  Bottom 0.254: N6.D0 12.05,30.49 13.34,29.21 15.88,29.21 17.14,27.94 19.68,27.94 20.95,26.67 Q61.3
N$28  (via drill 0.35)  (2 unrouted)
  Top 0.254: v133.35,6.35 131.47,6.35 129.56,4.45 128.25,4.45 126.34,6.35 v124.46,6.35
N$29
  Top 0.254: N5.A 36.83,29.21 34.92,27.3 33.02,27.3 27.94,32.38 27.94,39.37 33.02,44.45 38.1,44.45 R3.P$1
N$30
  Bottom 0.254: IC2.15 116.84,8.26 112.39,12.7 R15.1
N$31
  Bottom 0.254: IC2.1 115.57,13.34 114.3,14.61 R16.1
N$32
  Bottom 0.254: IC2.2 116.84,14.93 R17.1
N$33
  Bottom 0.254: IC2.3 R18.1
N$34
  Bottom 0.254: IC2.4 119.38,13.97 120.02,14.61 R19.1
N$35
  Bottom 0.254: IC2.5 120.65,13.34 121.92,14.61 R20.1
N$36
  Bottom 0.254: IC2.6 121.92,13.34 123.83,15.24 R21.1
N$37
  Bottom 0.254: IC2.7 123.19,13.34 124.14,14.29 124.78,14.29 125.73,15.24 R22.1
N$38
  Bottom 0.254: Q17.1 96.83,17.78 R23.2
N$39
  Bottom 0.254: Q24.1 109.22,23.35 109.22,19.05 111.12,17.14 110.81,17.14 R30.2
N$40
  Top 0.254: N6.A 17.14,29.21 15.24,27.3 13.34,27.3 8.26,32.38 8.26,39.37 13.34,44.45 17.78,44.45 R6.P$1
N$41
  Bottom 0.254: Q23.1 108.27,17.78 R29.2
N$42
  Bottom 0.254: Q22.1 105.41,23.35 105.41,19.05 106.68,17.78 R28.2
N$43
  Bottom 0.254: Q21.1 104.45,17.78 R27.2
N$44
  Bottom 0.254: Q20.1 101.6,23.35 101.6,19.05 102.87,17.78 R26.2
N$45
  Bottom 0.254: Q19.1 100.64,17.78 R25.2
N$46
  Bottom 0.254: Q18.1 97.79,23.35 97.79,19.05 99.06,17.78 R24.2
N$47
  Bottom 0.254: IC3.15 101.6,8.26 97.16,12.7 R23.1
N$48
  Bottom 0.254: IC3.1 100.33,13.34 99.06,14.61 R24.1
N$49
  Bottom 0.254: IC3.2 101.6,14.93 R25.1
N$50
  Bottom 0.254: IC3.3 R26.1
N$51
  Bottom 0.254: IC3.4 104.14,13.97 104.78,14.61 R27.1
N$52
  Bottom 0.254: IC3.5 105.41,13.34 106.68,14.61 R28.1
N$53
  Bottom 0.254: IC3.6 106.68,13.34 108.58,15.24 R29.1
N$54
  Bottom 0.254: IC3.7 107.95,13.34 108.9,14.29 109.54,14.29 110.49,15.24 R30.1
N$55
  Top 0.254: N4.A 64.77,29.21 62.87,27.3 60.96,27.3 55.88,32.38 55.88,39.37 60.96,44.45 66.04,44.45 R4.P$1
N$56
  Top 0.254: N3.A 84.45,29.21 82.55,27.3 80.64,27.3 75.56,32.38 75.56,39.37 80.64,44.45 86.36,44.45 R5.P$1
N$57  (via drill 0.35)  (2 unrouted)
  Top 0.254: v102.87,6.35 100.99,6.35 99.08,4.45 97.77,4.45 95.86,6.35 v93.98,6.35
N$58
  Bottom 0.254: Q62.3 22.41,26.5 22.24,26.67 N6.D1
N$59  (via drill 0.35)  (2 unrouted)
  Top 0.254: v35.56,6.35 33.68,6.35 31.77,4.45 30.46,4.45 28.55,6.35 v26.67,6.35
N$60
  Bottom 0.254: N6.D2 23.5,34.83 23.5,27.94 24.77,26.67 Q63.3
N$61
  Bottom 0.254: N6.D3 24.77,36.15 24.77,28.57 26.67,26.67 Q64.3
N$63
  Bottom 0.254: Q25.1 81.59,17.78 R31.2
N$64
  Bottom 0.254: Q32.1 93.98,23.35 93.98,19.05 95.25,17.78 R38.2
N$65
  Bottom 0.254: Q31.1 93.03,17.78 R37.2
N$66
  Bottom 0.254: Q30.1 90.17,23.35 90.17,19.05 91.44,17.78 R36.2
N$67
  Bottom 0.254: Q29.1 89.22,17.78 R35.2
N$68
  Bottom 0.254: Q28.1 86.36,23.35 86.36,19.05 87.63,17.78 R34.2
N$69
  Bottom 0.254: Q27.1 85.41,17.78 R33.2
N$70
  Bottom 0.254: Q26.1 82.55,23.35 82.55,19.05 83.82,17.78 R32.2
N$71
  Bottom 0.254: IC4.15 86.36,8.26 81.92,12.7 R31.1
N$72
  Bottom 0.254: IC4.1 85.09,13.34 83.82,14.61 R32.1
N$73
  Bottom 0.254: IC4.2 86.36,14.93 R33.1
N$74
  Bottom 0.254: IC4.3 R34.1
N$75
  Bottom 0.254: IC4.4 88.9,13.97 89.53,14.61 R35.1
N$76
  Bottom 0.254: IC4.5 90.17,13.34 91.44,14.61 R36.1
N$77
  Bottom 0.254: IC4.6 91.44,13.34 93.34,15.24 R37.1
N$78
  Bottom 0.254: IC4.7 92.71,13.34 93.66,14.29 94.3,14.29 95.25,15.24 R38.1
N$79
  Bottom 0.254: Q33.1 60.01,17.78 R39.2
N$80
  Bottom 0.254: Q40.1 72.39,23.35 72.39,19.05 73.66,17.78 R46.2
N$81
  Bottom 0.254: Q39.1 71.44,17.78 R45.2
N$82
  Bottom 0.254: Q38.1 68.58,23.35 68.58,19.05 69.85,17.78 70.48,17.78 70.17,17.46 R44.2
N$83
  Top 0.254: N2.A 112.39,29.21 110.49,27.3 108.58,27.3 103.5,32.38 103.5,39.37 108.58,44.45 114.3,44.45 R1.P$1
N$84
  Top 0.254: N1.A 132.08,29.21 130.18,27.3 128.27,27.3 123.19,32.38 123.19,39.37 128.27,44.45 133.99,44.45 R2.P$1
N$87
  Bottom 0.254: N6.D4 22.3,39.37 23.5,39.37 25.4,37.47 25.4,29.84 28.57,26.67 Q49.3
N$88
  Bottom 0.254: N6.D5 21.71,41.79 26.04,37.47 26.04,30.48 30.02,26.5 Q50.3
N$89
  Bottom 0.254: N6.D6 12.58,41.79 8.26,37.47 8.26,31.75 13.34,26.67 Q57.3
N$90
  Bottom 0.254: N6.D7 13.04,40.34 12.06,39.37 10.79,39.37 8.89,37.47 8.89,31.75 13.97,26.67 15.07,26.67 Q58.3
N$91
  Bottom 0.254: N6.D8 11.31,37.98 9.53,36.2 9.53,31.75 13.34,27.94 15.88,27.94 17.14,26.67 Q59.3
N$92
  Bottom 0.254: N6.D9 10.79,34.83 10.79,31.11 13.34,28.57 15.88,28.57 17.78,26.67 18.88,26.67 Q60.3
N$95
  Bottom 0.254: Q37.1 67.62,17.78 R43.2
N$96
  Bottom 0.254: Q36.1 64.77,23.35 64.77,19.05 66.04,17.78 66.67,17.78 66.36,17.46 R42.2
N$97
  Bottom 0.254: Q35.1 63.81,17.78 R41.2
N$98
  Bottom 0.254: Q34.1 60.96,23.35 60.96,19.05 62.23,17.78 R40.2
N$99
  Bottom 0.254: IC5.15 64.77,8.26 60.33,12.7 R39.1
N$100
  Bottom 0.254: IC5.1 63.5,13.34 62.23,14.61 R40.1
N$101
  Bottom 0.254: IC5.2 64.77,14.93 R41.1
N$102
  Bottom 0.254: IC5.3 R42.1
N$107
  Bottom 0.254: N3.D0 79.36,30.49 80.64,29.21 83.19,29.21 84.45,27.94 87,27.94 88.27,26.67 Q29.3
N$108
  Bottom 0.254: Q30.3 90.17,26.67 89.53,27.3 89.53,32.25 N3.D1
N$109
  Bottom 0.254: N3.D2 90.81,34.83 90.81,27.94 92.08,26.67 Q31.3
N$110
  Bottom 0.254: N3.D3 92.08,36.15 92.08,28.57 93.98,26.67 Q32.3
N$111
  Bottom 0.254: N3.D4 89.61,39.37 90.81,39.37 92.71,37.47 92.71,29.84 95.89,26.67 Q17.3
N$112
  Bottom 0.254: N5.D0 31.74,30.49 33.02,29.21 34.92,29.21 36.2,27.94 38.73,27.94 40.01,26.67 Q55.3
N$118
  Bottom 0.254: N3.D5 89.02,41.79 93.34,37.47 93.34,30.48 97.33,26.5 Q18.3
N$119
  Bottom 0.254: N3.D6 82.86,41.91 80.01,41.91 75.56,37.47 75.56,31.75 80.64,26.67 Q25.3
N$120
  Bottom 0.254: N3.D7 80.35,40.34 79.38,39.37 78.11,39.37 76.2,37.47 76.2,31.75 81.28,26.67 82.38,26.67 Q26.3
N$121
  Bottom 0.254: N3.D8 78.62,37.98 76.83,36.2 76.83,31.75 80.64,27.94 83.19,27.94 84.45,26.67 Q27.3
N$122
  Bottom 0.254: N3.D9 78.11,34.83 78.11,31.11 80.64,28.57 83.19,28.57 85.09,26.67 86.19,26.67 Q28.3
N$123
  Bottom 0.254: IC5.4 67.31,13.97 67.94,14.61 R43.1
N$124
  Bottom 0.254: IC5.5 68.58,13.34 69.85,14.61 R44.1
N$125
  Bottom 0.254: IC5.6 69.85,13.34 71.75,15.24 R45.1
N$126
  Bottom 0.254: IC5.7 71.12,13.34 72.07,14.29 72.71,14.29 73.66,15.24 R46.1
N$127
  Bottom 0.254: Q41.1 44.77,17.78 R47.2
N$128
  Bottom 0.254: Q48.1 57.15,23.35 57.15,19.05 58.42,17.78 59.05,17.78 58.73,17.46 R54.2
N$129
  Bottom 0.254: Q47.1 56.2,17.78 R53.2
N$130
  Bottom 0.254: Q46.1 53.34,23.35 53.34,19.05 54.61,17.78 55.24,17.78 54.92,17.46 R52.2
N$131
  Bottom 0.254: N2.D0 107.3,30.49 111.12,26.67 Q9.3
N$132
  Bottom 0.254: N2.D1 117.49,30.49 114.94,27.94 114.3,27.94 113.03,26.67 Q10.3
N$133
  Bottom 0.254: N2.D2 118.54,30.91 114.94,27.3 Q11.3
N$134
  Bottom 0.254: N2.D3 120.02,36.15 120.02,31.11 116.84,27.94 Q12.3
N$135
  Bottom 0.254: N2.D4 117.55,39.37 118.75,39.37 120.65,37.47 120.65,30.48 118.75,28.57 Q13.3
N$136
  Bottom 0.254: N2.D5 114.18,41.79 114.3,41.91 116.84,41.91 121.28,37.47 121.28,29.84 120.65,29.21 Q14.3
N$137
  Bottom 0.254: N2.D6 110.61,41.79 110.49,41.91 107.95,41.91 103.5,37.47 Q21.3
N$138
  Bottom 0.254: N2.D7 108.29,40.34 107.31,39.37 106.05,39.37 104.14,37.47 104.14,27.94 105.41,26.67 Q22.3
N$139
  Bottom 0.254: N2.D8 105.97,37.98 104.78,36.78 104.78,29.21 107.31,26.67 Q23.3
N$140
  Bottom 0.254: N2.D9 106.05,34.83 106.05,29.21 108.75,26.5 Q24.3
N$141
  Bottom 0.254: N1.D0 126.99,29.86 130.18,26.67 Q3.3
N$142
  Bottom 0.254: N1.D1 137.17,30.49 134.62,27.94 133.35,27.94 132.08,26.67 Q4.3
N$143
  Bottom 0.254: N1.D2 138.22,30.91 133.99,26.67 Q5.3
N$144
  Bottom 0.254: N1.D3 139.7,36.15 139.7,31.11 135.89,27.3 Q6.3
N$145
  Bottom 0.254: N1.D4 137.23,39.37 138.43,39.37 140.34,37.47 140.34,30.48 137.79,27.94 Q7.3
N$146
  Bottom 0.254: N1.D5 133.87,41.79 133.99,41.91 136.53,41.91 140.97,37.47 140.97,29.84 139.7,28.57 Q8.3
N$147
  Bottom 0.254: N1.D6 130.29,41.79 130.18,41.91 127.64,41.91 122.56,36.83 Q15.3 122.56,21.59
N$148
  Bottom 0.254: N1.D7 127.97,40.34 127,39.37 125.73,39.37 123.83,37.47 123.83,26.67 124,26.5 Q16.3
N$149
  Bottom 0.254: N1.D8 125.66,37.98 124.46,36.78 124.46,28.57 126.36,26.67 Q1.3
N$150
  Bottom 0.254: N1.D9 125.73,34.83 125.73,29.21 128.27,26.67 Q2.3
N$151
  Bottom 0.254: Q45.1 52.38,17.78 R51.2
N$152
  Bottom 0.254: Q44.1 49.53,23.35 49.53,19.05 50.8,17.78 51.44,17.78 51.12,17.46 R50.2
N$153
  Bottom 0.254: Q43.1 48.58,17.78 R49.2
N$154
  Bottom 0.254: Q42.1 45.72,23.35 45.72,19.05 46.99,17.78 R48.2
N$155
  Bottom 0.254: IC6.15 49.53,8.26 45.09,12.7 R47.1
N$156
  Bottom 0.254: IC6.1 48.26,13.34 46.99,14.61 R48.1
N$157
  Bottom 0.254: IC6.2 49.53,14.93 R49.1
N$158
  Bottom 0.254: IC6.3 R50.1
N$159
  Bottom 0.254: IC6.4 52.07,13.97 52.7,14.61 R51.1
N$160
  Bottom 0.254: IC6.5 53.34,13.34 54.61,14.61 R52.1
N$161
  Bottom 0.254: IC6.6 54.61,13.34 56.52,15.24 R53.1
N$162
  Bottom 0.254: IC6.7 55.88,13.34 56.83,14.29 57.47,14.29 58.42,15.24 R54.1
N$163
  Bottom 0.254: Q49.1 29.52,17.78 R55.2
N$164
  Bottom 0.254: Q56.1 41.91,23.35 41.91,19.05 43.18,17.78 43.81,17.78 43.49,17.46 R62.2
N$165
  Bottom 0.254: Q55.1 40.95,17.78 R61.2
N$166
  Bottom 0.254: Q54.1 38.1,23.35 38.1,19.05 39.37,17.78 R60.2
N$167
  Bottom 0.254: Q53.1 37.15,17.78 R59.2
N$168
  Bottom 0.254: Q52.1 34.29,23.35 34.29,19.05 35.56,17.78 R58.2
N$169
  Bottom 0.254: Q51.1 33.34,17.78 R57.2
N$170
  Bottom 0.254: Q50.1 30.48,23.35 30.48,19.05 31.75,17.78 R56.2
N$171
  Bottom 0.254: IC7.15 34.29,8.26 29.84,12.7 R55.1
N$172
  Bottom 0.254: IC7.1 33.02,13.34 31.75,14.61 R56.1
N$173
  Bottom 0.254: IC7.2 34.29,14.93 R57.1
N$174
  Bottom 0.254: IC7.3 R58.1
N$175
  Bottom 0.254: IC7.4 36.83,13.97 37.47,14.61 R59.1
N$176
  Bottom 0.254: IC7.5 38.1,13.34 39.37,14.61 R60.1
N$177
  Bottom 0.254: IC7.6 39.37,13.34 41.27,15.24 R61.1
N$178
  Bottom 0.254: IC7.7 40.64,13.34 41.59,14.29 42.23,14.29 43.18,15.24 R62.1
N$179
  Bottom 0.254: Q57.1 14.29,17.78 R63.2
N$180
  Bottom 0.254: Q64.1 26.67,23.35 26.67,19.05 27.94,17.78 28.57,17.78 28.25,17.46 R70.2
N$181
  Bottom 0.254: Q63.1 25.71,17.78 R69.2
N$182
  Bottom 0.254: Q62.1 22.86,23.35 22.86,19.05 24.13,17.78 24.77,17.78 24.45,17.46 R68.2
N$183
  Bottom 0.254: Q61.1 21.91,17.46 22.23,17.14 R67.2
N$184
  Bottom 0.254: Q60.1 19.05,23.35 19.05,19.05 20.32,17.78 R66.2
N$185
  Bottom 0.254: Q59.1 18.09,17.78 R65.2
N$186
  Bottom 0.254: Q58.1 15.24,23.35 15.24,19.05 16.51,17.78 R64.2
N$187
  Bottom 0.254: IC8.15 19.05,8.26 14.61,12.7 R63.1
N$188
  Bottom 0.254: IC8.1 17.78,13.34 16.51,14.61 R64.1
N$189
  Bottom 0.254: IC8.2 19.05,14.93 R65.1
N$190
  Bottom 0.254: IC8.3 R66.1
N$191
  Bottom 0.254: IC8.4 21.59,13.97 22.23,14.61 R67.1
N$192
  Bottom 0.254: IC8.5 22.86,13.34 24.13,14.61 R68.1
N$193
  Bottom 0.254: IC8.6 24.13,13.34 26.04,15.24 R69.1
N$194
  Bottom 0.254: IC8.7 25.4,13.34 26.35,14.29 26.99,14.29 27.94,15.24 R70.1
N$195
  Bottom 0.254: Q56.3 41.92,26.51 N5.D1
N$196
  Bottom 0.254: N5.D2 43.18,34.83 43.18,27.94 43.81,27.3 Q41.3
N$197
  Bottom 0.254: N5.D3 44.45,36.15 44.45,27.94 45.72,26.67 Q42.3
N$198
  Bottom 0.254: N5.D4 41.98,39.37 43.18,39.37 45.09,37.47 45.09,29.21 47.62,26.67 Q43.3
N$199
  Bottom 0.254: N5.D5 41.39,41.79 45.72,37.47 45.72,29.84 49.06,26.5 Q44.3
N$200
  Bottom 0.254: N5.D6 32.27,41.79 27.94,37.47 27.94,31.11 32.38,26.67 Q51.3
N$201
  Bottom 0.254: N5.D7 32.73,40.34 31.75,39.37 30.48,39.37 28.57,37.47 28.57,31.11 33.02,26.67 34.12,26.67 Q52.3
N$202
  Bottom 0.254: N5.D8 30.99,37.98 29.21,36.2 29.21,31.11 32.38,27.94 34.92,27.94 36.2,26.67 Q53.3
N$203
  Bottom 0.254: N5.D9 30.48,34.83 30.48,30.48 32.38,28.57 34.92,28.57 36.83,26.67 37.93,26.67 Q54.3
N$204
  Bottom 0.254: N4.D0 59.68,29.86 62.87,26.67 Q35.3
N$205
  Bottom 0.254: N4.D1 69.86,30.49 67.31,27.94 66.04,27.94 64.77,26.67 Q36.3
N$206
  Bottom 0.254: N4.D2 70.92,30.91 66.67,26.67 Q37.3
N$207
  Bottom 0.254: N4.D3 72.39,36.15 72.39,31.11 68.58,27.3 Q38.3
N$208
  Bottom 0.254: N4.D4 69.92,39.37 71.12,39.37 73.03,37.47 73.03,30.48 70.48,27.94 Q39.3
N$209
  Bottom 0.254: N4.D5 66.56,41.79 66.67,41.91 69.22,41.91 73.66,37.47 73.66,29.84 72.39,28.57 Q40.3
N$210
  Bottom 0.254: N4.D6 62.98,41.79 62.87,41.91 60.33,41.91 55.24,36.83 Q47.3
N$211
  Bottom 0.254: N4.D7 60.66,40.34 59.69,39.37 58.42,39.37 56.52,37.47 56.52,27.3 57.15,26.67 Q48.3
N$212
  Bottom 0.254: N4.D8 58.35,37.98 57.15,36.78 57.15,28.57 59.05,26.67 Q33.3 59.05,21.76
N$213
  Bottom 0.254: N4.D9 58.42,34.83 58.42,29.21 60.96,26.67 Q34.3
VIN
  Bottom 0.254: R6.P$2 36.2,45.72 38.1,47.62 40.64,47.62 42.55,45.72 R3.P$2 R4.P$2 64.14,45.72 66.04,47.62 68.58,47.62 70.48,45.72 84.45,45.72 86.36,47.62 88.9,47.62 90.81,45.72 R5.P$2 R1.P$2 112.39,45.72 114.3,47.62 116.84,47.62 118.75,45.72 R2.P$2 132.08,45.72 133.99,47.62 136.53,47.62 144.15,40.01 JP1.1

### Text on the board
tNames: A | A | A | A | A | A | GND
bNames: D1